# Altium schematic sheet Logic.SchDoc
size A4; SheetNumber: 2; SheetTotal: 2
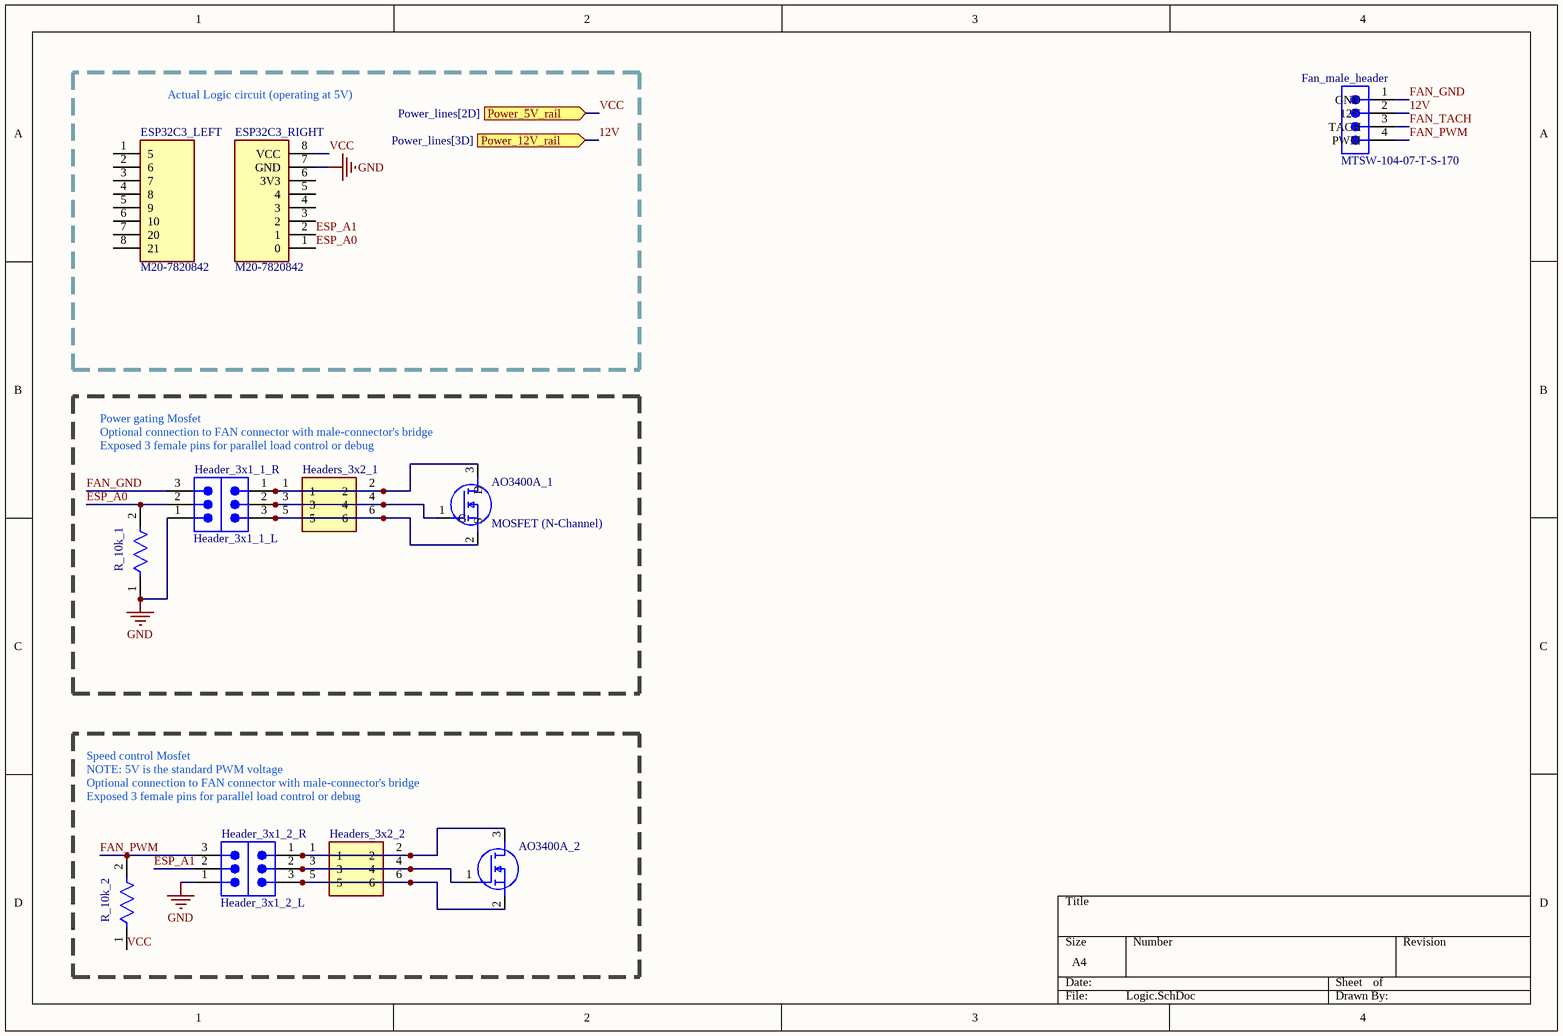
[diagram p0: Logic.SchDoc]

## Parts
AO3400A_1  MOSFET (N-Channel)  [SOT95P280X125-3N]
AO3400A_2  MOSFET (N-Channel)  [SOT95P280X125-3N]  (value not drawn)
ESP32C3_LEFT  M20-7820842  [RHDR8W80P0X254_1X8_2032X254X850P]
ESP32C3_RIGHT  M20-7820842  [RHDR8W80P0X254_1X8_2032X254X850P]
Fan_male_header  MTSW-104-07-T-S-170  [SMTC-MTSW-104-07-X-S-170]
Header_3x1_1_L  TSW-103-07-T-S  [SMTC-TSW-103-07-X-S]  (value not drawn)
Header_3x1_1_R  TSW-103-07-T-S  [SMTC-TSW-103-07-X-S]  (value not drawn)
Header_3x1_2_L  TSW-103-07-T-S  [SMTC-TSW-103-07-X-S]  (value not drawn)
Header_3x1_2_R  TSW-103-07-T-S  [SMTC-TSW-103-07-X-S]  (value not drawn)
Headers_3x2_1  Female header 3x2  [RHDR6W50P200X200_2X3_650X400X430P]  (value not drawn)
Headers_3x2_2  Female header 3x2  [RHDR6W50P200X200_2X3_650X400X430P]  (value not drawn)
R_10k_1  CRGCQ1206F10K  [FP-CRGCQ1206-IPC_C]  (value not drawn)
R_10k_2  CRGCQ1206F10K  [FP-CRGCQ1206-IPC_C]  (value not drawn)

## Ports
Power_5V_rail (in, see Power_lines[2D]), Power_12V_rail (in, see Power_lines[3D])

## Nets
GND: ESP32C3_RIGHT.7(GND) Header_3x1_1_L.1 Header_3x1_2_L.1 R_10k_1.1
12V: Fan_male_header.2(12V) ; port Power_12V_rail
ESP_A0: ESP32C3_RIGHT.1(0) Header_3x1_1_L.2 R_10k_1.2
ESP_A1: ESP32C3_RIGHT.2(1) Header_3x1_2_L.2
FAN_GND: Fan_male_header.1(GND) Header_3x1_1_L.3
FAN_PWM: Fan_male_header.4(PWM) Header_3x1_2_L.3 R_10k_2.2
FAN_TACH: Fan_male_header.3(TACH)
VCC: ESP32C3_RIGHT.8(VCC) R_10k_2.1 ; port Power_5V_rail
NetAO3400A_1_1: AO3400A_1.1(G) Header_3x1_1_R.2 Headers_3x2_1.3 Headers_3x2_1.4
NetAO3400A_1_2: AO3400A_1.2(S) Header_3x1_1_R.3 Headers_3x2_1.5 Headers_3x2_1.6
NetAO3400A_1_3: AO3400A_1.3(D) Header_3x1_1_R.1 Headers_3x2_1.1 Headers_3x2_1.2
NetAO3400A_2_1: AO3400A_2.1(G) Header_3x1_2_R.2 Headers_3x2_2.3 Headers_3x2_2.4
NetAO3400A_2_2: AO3400A_2.2(S) Header_3x1_2_R.3 Headers_3x2_2.5 Headers_3x2_2.6
NetAO3400A_2_3: AO3400A_2.3(D) Header_3x1_2_R.1 Headers_3x2_2.1 Headers_3x2_2.2

Not connected (* = marked no-connect by the designer): ESP32C3_LEFT 1(5) 2(6) 3(7) 4(8) 5(9) 6(10) 7(20) 8(21); ESP32C3_RIGHT 3(2) 4(3) 5(4) 6(3V3)

## Notes on the sheet
- Actual Logic circuit (operating at 5V)
- Power gating Mosfet
  Optional connection to FAN connector with male-connector's bridge
  Exposed 3 female pins for parallel load control or debug
- Speed control Mosfet
  NOTE: 5V is the standard PWM voltage
  Optional connection to FAN connector with male-connector's bridge
  Exposed 3 female pins for parallel load control or debug

## Library data of the parts
AO3400A_1 AO3400A_2 = AO3400A: Manufacturer_Name: Alpha & Omega Semiconductors; Datasheet Link: http://aosmd.com/res/data_sheets/AO3400A.pdf; Height: 1.25mm; Manufacturer_Part_Number: AO3400A; Arrow Part Number: AO3400A; Arrow Price/Stock: https://www.arrow.com/en/products/ao3400a/alpha-and-omega-semiconductor?utm_currency=USD&region=nac
ESP32C3_LEFT ESP32C3_RIGHT = M20-7820842: Connector; Manufacturer_Name: Harwin; Datasheet Link: https://content.harwin.com/m/c2ac50ebb1c800d5/original/DRG-00385-Technical-Drawing-Datasheet-M20-782-pdf.pdf; Height: 8.5mm; Manufacturer_Part_Number: M20-7820842; Mouser Part Number: 855-M20-7820842; Mouser Price/Stock: https://www.mouser.co.uk/ProductDetail/Harwin/M20-7820842?qs=WS5Jv%252B%252Bx1qXOep0XOTvy2Q%3D%3D
Fan_male_header = CMP-1024-00105-1: Modified .025" SQ Post Header, Through-hole, Vertical, -55 to 105 degC, 2.54 mm Pitch, 4-Pin, Male, RoHS; Manufacturer: Samtec; Pitch: 2.54 mm; PartNumber: MTSW-104-07-T-S-170; ComponentLink3Description: Package Specification; ComponentLink2URL: http://www.samtec.com/documents/webfiles/pdf/MTSW.PDF; Temperature Range: -55 to 105 degC; DatasheetVersion: F-214; ComponentLink3URL: http://www.samtec.com/documents/webfiles/cpdf/MTSW-XXX-XX-X-X-XXXX-XX-XXX-MKT1.pdf; Orientation: Vertical; ComponentLink1URL: http://www.samtec.com; RoHS: True; PackageReference: MTSW-104-07-X-S-170; ComponentLink1Description: Manufacturer URL; Mounting Technology: Through-hole; PackageDescription: Assembly .025" [.64] SQ Post Terminal Strip; PackageVersion: BI, 2/1987; ComponentLink2Description: Datasheet
Header_3x1_1_L Header_3x1_1_R Header_3x1_2_L Header_3x1_2_R = CMP-1024-00332-1: 0.025" SQ Post Header, Through-hole, Vertical, -55 to 105 degC, 2.54 mm Pitch, 3-Pin, Male, RoHS; Manufacturer: Samtec; Pitch: 2.54 mm; ComponentLink1URL: http://www.samtec.com; ComponentLink3URL: http://www.samtec.com/documents/webfiles/cpdf/TSW-XXX-XX-XXX-X-XX-XXX-MKT.pdf; PartNumber: TSW-103-07-T-S; Mounting Technology: Through-hole; RoHS: True; DatasheetVersion: F-214; PackageVersion: DM, 8/1988; Temperature Range: -55 to 105 degC; ComponentLink2Description: Datasheet; ComponentLink1Description: Manufacturer URL; Orientation: Vertical; PackageReference: TSW-103-07-X-S; ComponentLink3Description: Package Specification; ComponentLink2URL: http://www.samtec.com/documents/webfiles/pdf/TSW_TH.PDF; PackageDescription: .025[0.64] SQ. Post Terminal Strip Assembly
Headers_3x2_1 Headers_3x2_2 = M22-7140342: Connector; Manufacturer_Name: Harwin; Datasheet Link: https://content.harwin.com/m/4af06443270d069b/original/DRG-00561-Technical-Drawing-Datasheet-M22-714-pdf.pdf; Height: 4.3mm; Manufacturer_Part_Number: M22-7140342; Mouser Part Number: 855-M22-7140342; Mouser Price/Stock: https://www.mouser.co.uk/ProductDetail/Harwin/M22-7140342?qs=93uzuGORGqdkFvC3%252BeKyAw%3D%3D
R_10k_1 R_10k_2 = CMP-03211-010884-1: CRGCQ1206 10KΩ 0.25W 1% ±100ppm/°C 200V; Manufacturer: TE Connectivity; Tolerance: 0.01; Automotive Grade: Grade 913; Value: 10KΩ; Automotive: Yes; Temperature: -55°C to +155°C; RoHS: TRUE; Series: CRGCQ; Lead Free: Yes; Device Class L3: Chip SMD Resistors; Package: CRGCQ1206; ComponentLink2URL: https://www.te.com/commerce/DocumentDelivery/DDEController?Action=showdoc&DocId=Data+Sheet%7F1773204-3%7F1%7Fpdf%7FEnglish%7FENG_DS_1773204-3_1.pdf%7F4-2176347-922; Ipc Land Pattern Name: RESC310155X55; Composition: Thick Film; Voltage Rating: 200V; Device Class L1: Passive Components; Temperature Range Low: -55°C; Resistance: 10KΩ; Height: 0.65mm; Power Rating: 0.25W; Device Class L2: Resistors; Temperature Range High: +155°C; Octopart: https://octopart.com/crgcq1206f10k-te+connectivity-91018244; Ambient Temperature Range High: +70°C; ComponentLink2Description: Datasheet; Temperature Coefficient: ±100ppm/°C; Manufacturer Part Number: CRGCQ1206F10K; Category: Res